# EAGLE design shield_mega_seed4_mpu_lobo9 (EAGLE 9.3.0)
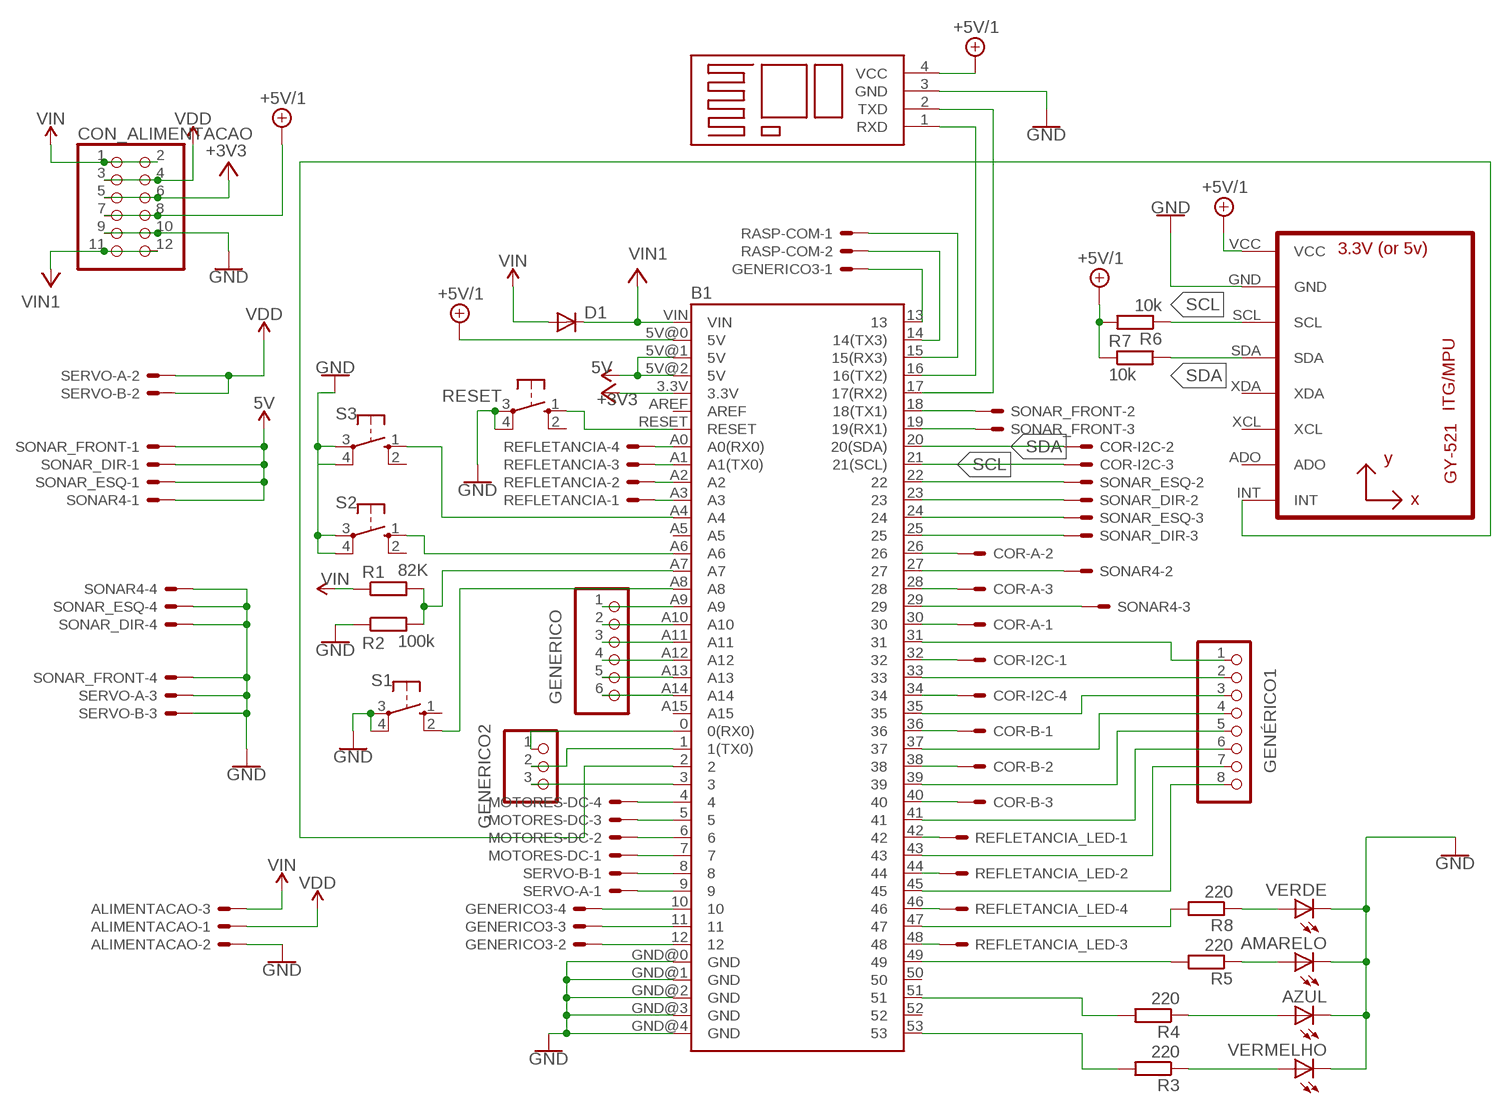
[diagram p0: schematic, sheet 1]

## Parts
ALIMENTACAO  22-23-2031  [22-23-2031]
AMARELO  LED5MM  [LED5MM]
AZUL  LED5MM  [LED5MM]
B1  ARDUINO_MEGA_R3FULL  [ARDUINO_MEGA]
B2  BLUETOOTH  [BLUETOOTH]
CON_ALIMENTACAO  PINHD-2X6  [2X06]
COR-A  22-23-2031  [22-23-2031]
COR-B  22-23-2031  [22-23-2031]
COR-I2C  22-23-2041  [22-23-2041]
D1  1N4004  [DO41-10]
GENERICO  PINHD-1X6  [1X06]
GENERICO2  PINHD-1X3  [1X03]
GENERICO3  22-23-2041  [22-23-2041]
GENÉRICO1  PINHD-1X8  [1X08]
MOTORES-DC  22-23-2041  [22-23-2041]
R1  82K  R-EU_0204/7  [0204/7]
R2  100k  R-EU_0204/7  [0204/7]
R3  220  R-EU_0207/7  [0207/7]
R4  220  R-EU_0207/7  [0207/7]
R5  220  R-EU_0207/7  [0207/7]
R6  10k  R-EU_0204/7  [0204/7]
R7  10k  R-EU_0204/7  [0204/7]
R8  220  R-EU_0207/7  [0207/7]
RASP-COM  22-23-2021  [22-23-2021]
REFLETANCIA  22-23-2041  [22-23-2041]
REFLETANCIA_LED  22-23-2041  [22-23-2041]
RESET  10-XX  [B3F-10XX]
S1  10-XX  [B3F-10XX]
S2  10-XX  [B3F-10XX]
S3  10-XX  [B3F-10XX]
SERVO-A  22-23-2031  [22-23-2031]
SERVO-B  22-23-2031  [22-23-2031]
SONAR4  22-23-2041  [22-23-2041]
SONAR_DIR  22-23-2041  [22-23-2041]
SONAR_ESQ  22-23-2041  [22-23-2041]
SONAR_FRONT  22-23-2041  [22-23-2041]
U1  GY-521MPU6050  [GY-521]
VERDE  LED5MM  [LED5MM]
VERMELHO  LED5MM  [LED5MM]

## Nets
5V: B1.5V@1(5V) B1.5V@2(5V) SONAR4.1 SONAR_DIR.1 SONAR_ESQ.1 SONAR_FRONT.1
+3V3: B1.3.3V CON_ALIMENTACAO.5 CON_ALIMENTACAO.6
+5V/1: B1.5V@0(5V) B2.4(VCC) CON_ALIMENTACAO.7 CON_ALIMENTACAO.8 R6.2 R7.1 U1.VCC
GND: ALIMENTACAO.2 AMARELO.K(C) AZUL.K(C) B1.GND@0(GND) B1.GND@1(GND) B1.GND@2(GND) B1.GND@3(GND) B1.GND@4(GND) B2.3(GND) CON_ALIMENTACAO.9 CON_ALIMENTACAO.10 R2.1 RESET.3(P) RESET.4(P1) S1.3(P) S1.4(P1) S2.3(P) S2.4(P1) S3.3(P) S3.4(P1) SERVO-A.3 SERVO-B.3 SONAR4.4 SONAR_DIR.4 SONAR_ESQ.4 SONAR_FRONT.4 U1.GND VERDE.K(C) VERMELHO.K(C)
N$1: B1.A2 REFLETANCIA.2
N$2: B1.A3 REFLETANCIA.1
N$3: B1.4 MOTORES-DC.4
N$4: B1.5 MOTORES-DC.3
N$5: B1.6 MOTORES-DC.2
N$6: B1.7 MOTORES-DC.1
N$7: B1.8 SERVO-B.1
N$8: B1.9 SERVO-A.1
N$9: B1.14(14(TX3)) RASP-COM.2
N$10: B1.15(15(RX3)) RASP-COM.1
N$11: B1.19(19(RX1)) SONAR_FRONT.3
N$12: B1.18(18(TX1)) SONAR_FRONT.2
N$13: B1.16(16(TX2)) B2.1(RXD)
N$14: B1.30 COR-A.1
N$15: B1.26 COR-A.2
N$16: B1.34 COR-I2C.4
N$17: B1.36 COR-B.1
N$18: B1.38 COR-B.2
N$19: B1.40 COR-B.3
N$20: B1.A7 R1.2 R2.2
N$21: B1.51 R4.2
N$22: B1.53 R3.2
N$23: B1.49 R5.2
N$24: AMARELO.A R5.1
N$25: AZUL.A R4.1
N$26: R3.1 VERMELHO.A
N$27: B1.27 SONAR4.2
N$28: B1.A6 S2.1(S)
N$29: B1.A1(A1(TX0)) REFLETANCIA.3
N$30: B1.29 SONAR4.3
N$31: B1.RESET RESET.1(S)
N$32: B1.0(0(RX0)) GENERICO2.1
N$33: B1.A0(A0(RX0)) REFLETANCIA.4
N$34: B1.25 SONAR_DIR.3
N$35: B1.24 SONAR_ESQ.3
N$36: B1.23 SONAR_DIR.2
N$37: B1.22 SONAR_ESQ.2
N$38: B1.47 R8.2
N$39: B1.2 U1.INT
N$40: B1.32 COR-I2C.1
N$41: B1.28 COR-A.3
N$42: R8.1 VERDE.A
N$43: B1.17(17(RX2)) B2.2(TXD)
N$44: B1.10 GENERICO3.4
N$45: B1.12 GENERICO3.2
N$46: B1.11 GENERICO3.3
N$47: B1.13 GENERICO3.1
N$48: B1.42 REFLETANCIA_LED.1
N$49: B1.44 REFLETANCIA_LED.2
N$50: B1.46 REFLETANCIA_LED.4
N$51: B1.48 REFLETANCIA_LED.3
N$52: B1.A14 GENERICO.6
N$53: B1.A13 GENERICO.5
N$54: B1.A12 GENERICO.4
N$55: B1.A11 GENERICO.3
N$56: B1.A10 GENERICO.2
N$57: B1.A9 GENERICO.1
N$58: B1.A8 S1.2(S1)
N$59: B1.A4 S3.1(S)
N$60: B1.31 GENÉRICO1.1
N$61: B1.33 GENÉRICO1.2
N$62: B1.35 GENÉRICO1.3
N$63: B1.37 GENÉRICO1.4
N$64: B1.39 GENÉRICO1.5
N$65: B1.41 GENÉRICO1.6
N$66: B1.43 GENÉRICO1.7
N$67: B1.45 GENÉRICO1.8
N$68: B1.1(1(TX0)) GENERICO2.2
N$69: B1.3 GENERICO2.3
SCL: B1.21(21(SCL)) COR-I2C.3 R6.1 U1.SCL
SDA: B1.20(20(SDA)) COR-I2C.2 R7.2 U1.SDA
V+: B1.VIN CON_ALIMENTACAO.11 CON_ALIMENTACAO.12 D1.C ; supply symbol labelled VIN1
VDD: ALIMENTACAO.1 CON_ALIMENTACAO.3 CON_ALIMENTACAO.4 SERVO-A.2 SERVO-B.2
VIN: ALIMENTACAO.3 CON_ALIMENTACAO.1 CON_ALIMENTACAO.2 D1.A R1.1
Unconnected: B1.50 B1.52 B1.A5 B1.A15 B1.AREF RESET.2(S1) S1.1(S) S2.2(S1) S3.2(S1) U1.ADO U1.XCL U1.XDA

## Library data of the parts
ALIMENTACAO COR-A COR-B SERVO-A SERVO-B = con-molex:22-23-2031: .100" (2.54mm) Center Header - 3 Pin; MF: MOLEX; MPN: 22-23-2031; OC_FARNELL: 1462950; OC_NEWARK: 30C0862
AMARELO AZUL VERDE VERMELHO = led:LED: LED OSRAM: - CHIPLED LG R971, LG N971, LY N971, LG Q971, LY Q971, LO R971, LY R971 LH N974, LH R974 LS Q976, LO Q976, LY Q976 LO Q996 - Hyper CHIPLED LW Q18S LB Q993, LB Q99A, LB R99A - SideLED LS A670, LO A670, LY A670, LG A670, LP A670 LB A673, LV A673, LT A673, LW A673 LH A674 LY A675 LS A676, LA A676, LO A676, LY A676, LW A676 LS A679, LY A679, LG A679 - Hyper Micro SIDELED® LS Y876, LA Y876, LO Y876, LY Y876 LT Y87S - SmartLED LW L88C, LW L88S LB L89C, LB L89S, LG L890 LS L89K, LO L89K, LY L89K LS L896, LA L896, LO L896, LY L896 - TOPLED LS T670, LO T670, LY T670, LG T670, LP T670 LSG T670, LSP T670, LSY T670, LOP T670, LYG T670 LG T671, LOG T671, LSG T671 LB T673, LV T673, LT T673, LW T673 LH T674 LS T676, LA T676, LO T676, LY T676, LB T676, LH T676, LSB T676, LW T676 LB T67C, LV T67C, LT T67C, LS T67K, LO T67K, LY T67K, LW E67C LS E67B, LA E67B, LO E67B, LY E67B, LB E67C, LV E67C, LT E67C LW T67C LS T679, LY T679, LG T679 LS T770, LO T770, LY T770, LG T770, LP T770 LB T773, LV T773, LT T773, LW T773 LH T774 LS E675, LA E675, LY E675, LS T675 LS T776, LA T776, LO T776, LY T776, LB T776 LHGB T686 LT T68C, LB T68C - Hyper Mini TOPLED® LB M676 - Mini TOPLED Santana® LG M470 LS M47K, LO M47K, LY M47K Source: http://www.osram.convergy.de LUXEON: - LUMILED® LXK2-PW12-R00, LXK2-PW12-S00, LXK2-PW14-U00, LXK2-PW14-V00 LXK2-PM12-R00, LXK2-PM12-S00, LXK2-PM14-U00 LXK2-PE12-Q00, LXK2-PE12-R00, LXK2-PE12-S00, LXK2-PE14-T00, LXK2-PE14-U00 LXK2-PB12-K00, LXK2-PB12-L00, LXK2-PB12-M00, LXK2-PB14-N00, LXK2-PB14-P00, LXK2-PB14-Q00 LXK2-PR12-L00, LXK2-PR12-M00, LXK2-PR14-Q00, LXK2-PR14-R00 LXK2-PD12-Q00, LXK2-PD12-R00, LXK2-PD12-S00 LXK2-PH12-R00, LXK2-PH12-S00 LXK2-PL12-P00, LXK2-PL12-Q00, LXK2-PL12-R00 Source: www.luxeon.com KINGBRIGHT: KA-3528ASYC Source: www.kingbright.com
B1 = SparkFun-Boards3:ARDUINO_MEGA_R3: Arduino Mega R3 ATmega2560 R3 compatible footprint. SparkFun Products: Arduino Mega 2560 R3 <https://www.sparkfun.com/products/11061>
B2 = Bluetooth:BLUETOOTH
CON_ALIMENTACAO = pinhead:PINHD-2X6: PIN HEADER
COR-I2C GENERICO3 MOTORES-DC REFLETANCIA REFLETANCIA_LED SONAR4 SONAR_DIR SONAR_ESQ SONAR_FRONT = con-molex:22-23-2041: .100" (2.54mm) Center Header - 4 Pin; MF: MOLEX; MPN: 22-23-2041; OC_FARNELL: 1462920; OC_NEWARK: 38C0355
D1 = diode:1N4004: DIODE general purpose rectifier, 1 A
GENERICO = pinhead:PINHD-1X6: PIN HEADER
GENERICO2 = pinhead:PINHD-1X3: PIN HEADER
GENÉRICO1 = pinhead:PINHD-1X8: PIN HEADER
R1-R8 = rcl:R-EU_: RESISTOR, European symbol
RASP-COM = con-molex:22-23-2021: .100" (2.54mm) Center Header - 2 Pin; MF: MOLEX; MPN: 22-23-2021; OC_FARNELL: 1462926; OC_NEWARK: 25C3832
RESET S1-S3 = switch-omron:10-XX: OMRON SWITCH; MPN: B3F-1000; OC_FARNELL: 176432; OC_NEWARK: 36M3542
U1 = gy-521:GY-521

## Board
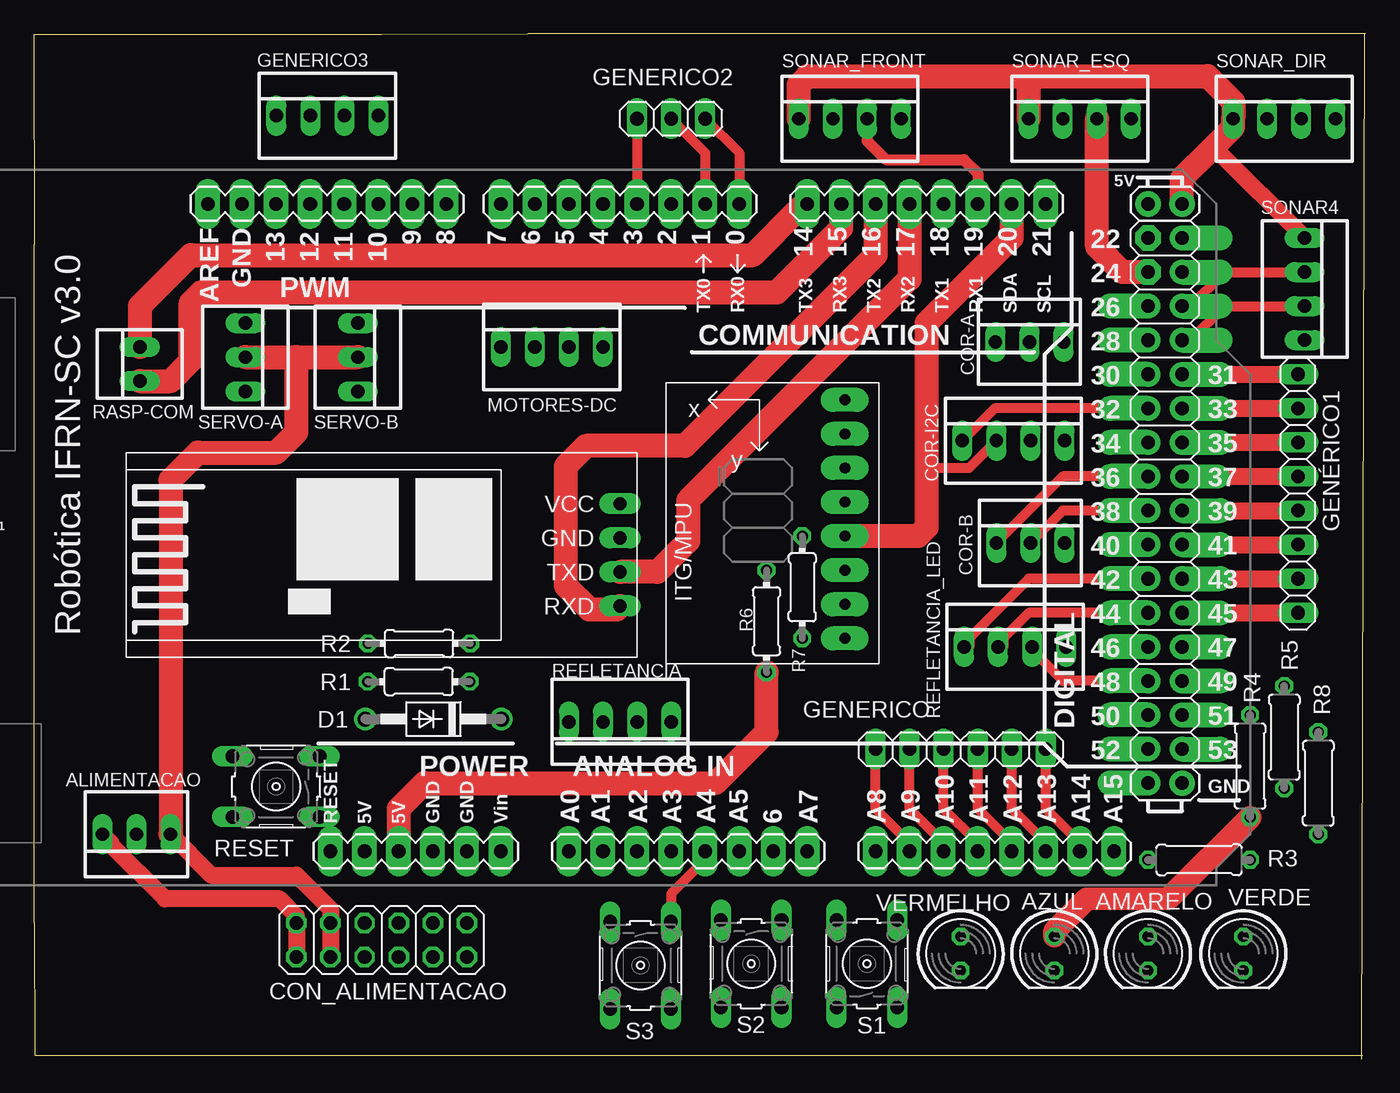
[diagram p1: board, top side]
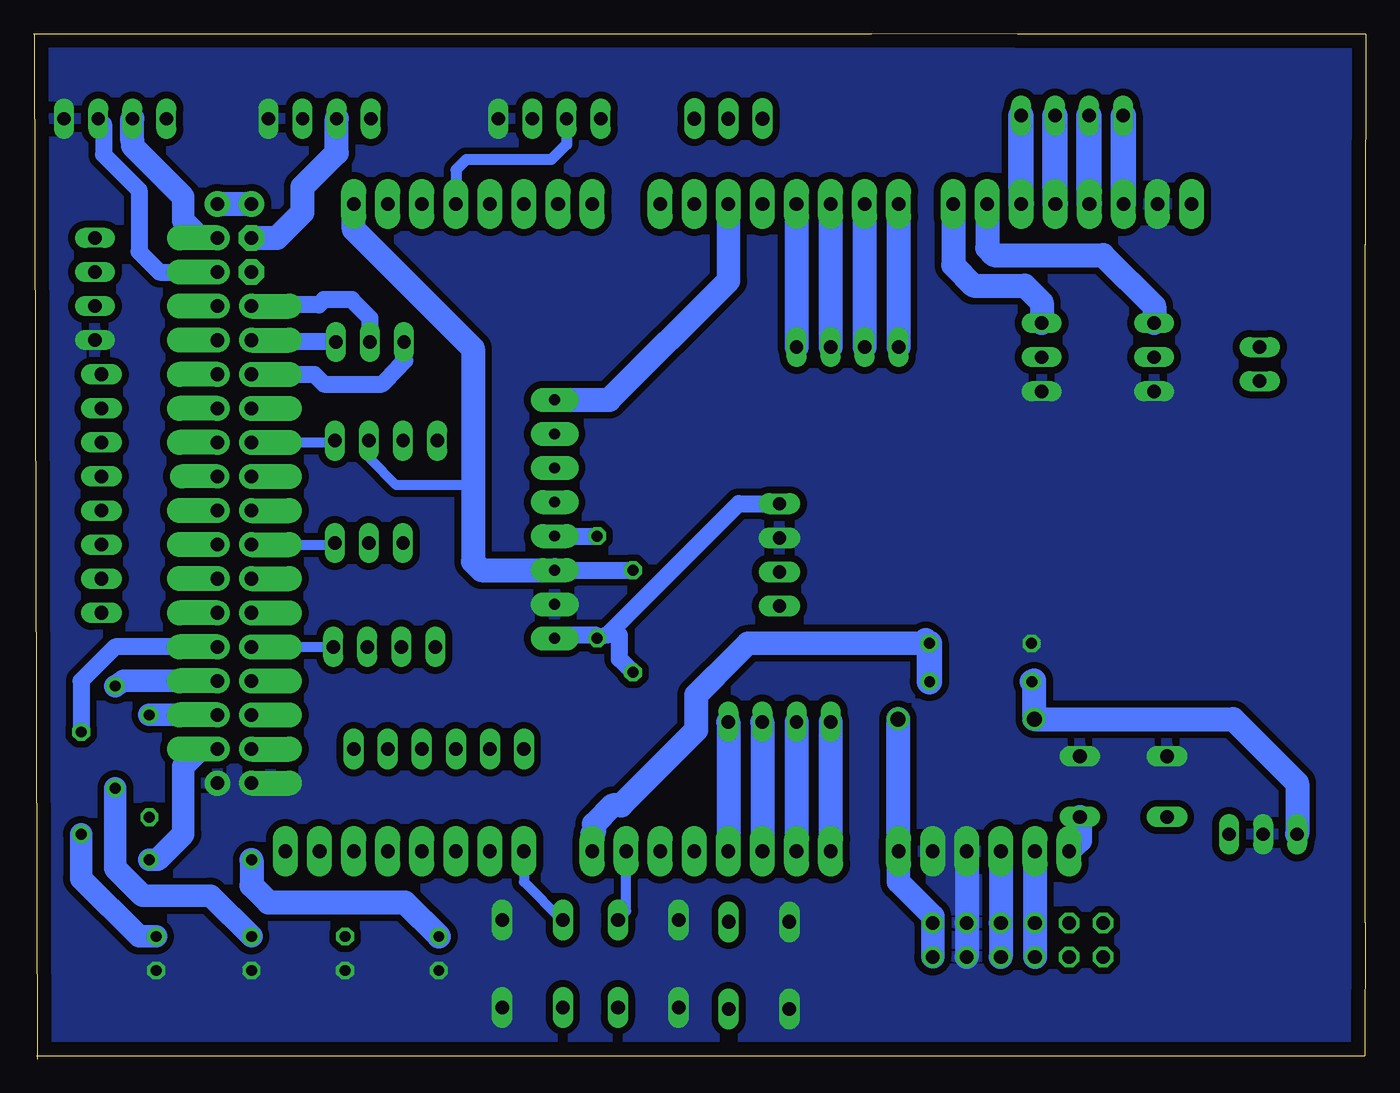
[diagram p2: board, bottom side, seen from below]

Size 99.36 x 76.45 mm. Coordinates in mm from the lower left corner, seen from the top.
Outline: 99.03,0 99.29,76.44
Outline: 99.11,0.25 0.1,0.25 0.05,10.16 0.05,60.71 0,76.4 25.96,76.4 36.88,76.45 99.36,76.45
Copper layers (1*16): Top 0.035mm / dielectric 1.5mm / Bottom 0.035mm
Design rules "default *": minimum track width 30mil, minimum drill 24mil, track to track 20mil, track to pad 20mil, pad to pad 20mil, via to via 20mil, smd to smd 8mil, copper to edge 40mil, drill to drill 8mil, minimum pad ring 10mil, minimum via ring 8mil, stop-mask expansion 4mil, vias tented up to drill 0mil, thermal gap 0mil

### Footprints (pad centres in the part's own frame; a part is rotated, then mirrored left to right if it is on the bottom)
22-23-2031 = drill 1 long: 1 -2.54,0; 2 0,0; 3 2.54,0
LED5MM = drill 0.813 octagon: A -1.27,0; K 1.27,0
ARDUINO_MEGA = drill 1.016 pad 1.88 long: 0 13.97,24.13; 1 11.43,24.13; 2 8.89,24.13; 3 6.35,24.13; 3.3V -13.97,-24.13; 4 3.81,24.13; 5 1.27,24.13; 5V@0 -11.43,-24.13; 6 -1.27,24.13; 7 -3.81,24.13; 8 -7.874,24.13; 9 -10.414,24.13; 10 -12.954,24.13; 11 -15.494,24.13; 12 -18.034,24.13; 13 -20.574,24.13; 14 19.05,24.13; 15 21.59,24.13; 16 24.13,24.13; 17 26.67,24.13; 18 29.21,24.13; 19 31.75,24.13; 20 34.29,24.13; 21 36.83,24.13; A0 1.27,-24.13; A1 3.81,-24.13; A2 6.35,-24.13; A3 8.89,-24.13; A4 11.43,-24.13; A5 13.97,-24.13; A6 16.51,-24.13; A7 19.05,-24.13; A8 24.13,-24.13; A9 26.67,-24.13; A10 29.21,-24.13; A11 31.75,-24.13; A12 34.29,-24.13; A13 36.83,-24.13; A14 39.37,-24.13; A15 41.91,-24.13; AREF -25.654,24.13; GND@0 -8.89,-24.13; GND@1 -6.35,-24.13; GND@4 -23.114,24.13; RESET -16.51,-24.13; VIN -3.81,-24.13 | drill 1.016 pad 1.88: 5V@1 44.45,24.13; 5V@2 46.99,24.13; GND@3 46.99,-19.05 | drill 1.016 pad 1.88 octagon: 22 44.45,21.59; 24 44.45,19.05 | drill 1.016 pad 1.88 offset: 23 46.99,21.59; 25 46.99,19.05; 26 44.45,16.51; 27 46.99,16.51; 28 44.45,13.97; 29 46.99,13.97; 30 44.45,11.43; 31 46.99,11.43; 32 44.45,8.89; 33 46.99,8.89; 34 44.45,6.35; 35 46.99,6.35; 36 44.45,3.81; 38 44.45,1.27; 39 46.99,1.27; 40 44.45,-1.27; 41 46.99,-1.27; 42 44.45,-3.81; 43 46.99,-3.81; 44 44.45,-6.35; 45 46.99,-6.35; 46 44.45,-8.89; 47 46.99,-8.89; 48 44.45,-11.43; 49 46.99,-11.43; 50 44.45,-13.97; 51 46.99,-13.97; 52 44.45,-16.51; 53 46.99,-16.51; GND@2 44.45,-19.05 | drill 1 pad 1.778 offset: 37 46.99,3.81
BLUETOOTH = drill 1 pad 1.549 long: 1 -6.35,3.81; 2 -6.35,1.27; 3 -6.35,-1.27; 4 -6.35,-3.81
2X06 = drill 1.016 octagon: 1 -6.35,-1.27; 2 -6.35,1.27; 3 -3.81,-1.27; 4 -3.81,1.27; 5 -1.27,-1.27; 6 -1.27,1.27; 7 1.27,-1.27; 8 1.27,1.27; 9 3.81,-1.27; 10 3.81,1.27; 11 6.35,-1.27; 12 6.35,1.27
22-23-2041 = drill 1 long: 1 -3.81,0; 2 -1.27,0; 3 1.27,0; 4 3.81,0
DO41-10 = drill 1.118: A 5.08,0; C -5.08,0
1X06 = drill 1.016 long: 1 -6.35,0; 2 -3.81,0; 3 -1.27,0; 4 1.27,0; 5 3.81,0; 6 6.35,0
1X03 = drill 1.016 long: 1 -2.54,0; 2 0,0; 3 2.54,0
1X08 = drill 1.016 long: 1 -8.89,0; 2 -6.35,0; 3 -3.81,0; 4 -1.27,0; 5 1.27,0; 6 3.81,0; 7 6.35,0; 8 8.89,0
0204/7 = drill 0.813 octagon: 1 -3.81,0; 2 3.81,0
0207/7 = drill 0.813 octagon: 1 -3.81,0; 2 3.81,0
22-23-2021 = drill 1 long: 1 -1.27,0; 2 1.27,0
B3F-10XX = drill 1.016 long: 1 -3.251,2.261; 2 3.251,2.261; 3 -3.251,-2.261; 4 3.251,-2.261
GY-521 = drill 0.8 pad 1.778 long: ADO -8.89,-6.35; GND -8.89,6.35; INT -8.89,-8.89; SCL -8.89,3.81; SDA -8.89,1.27; VCC -8.89,8.89; XCL -8.89,-3.81; XDA -8.89,-1.27

### Placement (x,y rotation side)
ALIMENTACAO  7.67,16.76 180 top
AMARELO  83.11,7.87 270 top
AZUL  76.12,7.87 270 top
B1  38.66,39.62 0 top
B2  37.39,37.59 180 top
CON_ALIMENTACAO  25.96,8.89 0 top
COR-A  74.27,53.47 0 top
COR-B  74.35,38.48 0 top
COR-I2C  73.08,46.1 0 top
D1  29.82,25.35 180 top
GENERICO  69.14,23.11 0 top
GENERICO2  47.55,70.1 180 top
GENERICO3  21.92,70.33 0 top
GENÉRICO1  94.28,42.16 270 top
MOTORES-DC  38.66,53.09 0 top
R1  28.73,28.14 0 top
R2  28.75,30.99 0 top
R3  86.92,14.86 0 top
R4  90.73,21.84 90 top
R5  93.27,24 90 top
R6  54.66,32.64 270 top
R7  57.33,35.18 90 top
R8  95.81,20.57 90 top
RASP-COM  7.92,51.82 90 top
REFLETANCIA  43.74,25.15 180 top
REFLETANCIA_LED  73.2,30.73 0 top
RESET  18.08,20.32 180 top
S1  62.15,7.11 90 top
S2  53.52,7.11 270 top
S3  45.26,6.99 270 top
SERVO-A  15.8,52.32 270 top
SERVO-B  24.18,52.32 270 top
SONAR4  94.79,57.4 270 top
SONAR_DIR  93.27,70.1 0 top
SONAR_ESQ  78.03,70.1 0 top
SONAR_FRONT  60.88,70.1 0 top
U1  51.61,40.26 180 top
VERDE  90.22,7.87 270 top
VERMELHO  69.14,7.87 270 top

### Tracks (layer width: path | path; a pad name or v marks a point on that pad's centre or on a via)
5V
  Top 1.27: SONAR4.1 88.13,67.88 87.87,67.88
  Top 1.778: B1.5V@2 85.65,65.66 87.87,67.88 89.46,69.47 SONAR_DIR.1 89.46,71.37 87.55,73.28 74.85,73.28 74.54,72.96 | SONAR_ESQ.1 74.22,72.64 74.54,72.96 | 74.54,72.96 74.22,73.28 57.71,73.28 57.07,72.64 SONAR_FRONT.1
  Bottom 1.778: B1.5V@2 B1.5V@1
+3V3
  Bottom 1.78: B1.3.3V CON_ALIMENTACAO.6 CON_ALIMENTACAO.5
+5V/1
  Top 1.778: B1.5V@0 27.23,18.67 29.13,20.57 50.85,20.57 54.66,24.38 R6.2
  Bottom 1.27: U1.VCC 60.12,31.62 57.45,31.62 R7.1 56.57,31.62 56.12,32.07 | B2.4 46.79,41.4 56.12,32.07 | R6.2 55.68,29.84 55.68,31.62 56.12,32.07
  Bottom 1.78: B1.5V@0 CON_ALIMENTACAO.8 CON_ALIMENTACAO.7
GND
  Bottom 0.762: 51.51,10.41 51.29,10.36 S2.3
  Bottom 1.778: B1.GND@3 85.7,20.52
  Bottom 1.78: B1.GND@0 CON_ALIMENTACAO.10 CON_ALIMENTACAO.9
  pour Bottom: -0.2,76.45 99.36,76.45 99.36,0.51 -0.2,0.51
N$1
  Bottom 1.778: REFLETANCIA.2 B1.A2
N$2
  Bottom 1.778: REFLETANCIA.1 B1.A3
N$3
  Bottom 1.778: B1.4 MOTORES-DC.4
N$4
  Bottom 1.778: B1.5 MOTORES-DC.3
N$5
  Bottom 1.778: B1.6 MOTORES-DC.2
N$6
  Bottom 1.778: B1.7 MOTORES-DC.1
N$7
  Bottom 1.778: B1.8 30.78,59.18 29.26,57.66 25.45,57.66 24.18,56.39 SERVO-B.1
N$8
  Bottom 1.778: B1.9 28.24,60.45 27.74,59.94 19.61,59.94 15.8,56.13 SERVO-A.1
N$9
  Top 1.778: B1.14 57.45,63.5 57.2,63.5 53.64,59.94 11.73,59.94 7.92,56.13 RASP-COM.2
N$10
  Top 1.778: B1.15 60.25,61.98 55.42,57.15 12.5,57.15 11.73,56.39 11.73,52.07 10.21,50.55 RASP-COM.1
N$11
  Top 0.813: SONAR_FRONT.3 62.15,68.45 63.55,67.06 69.39,67.06 70.41,66.04 B1.19
N$12
  Bottom 0.813: SONAR_FRONT.2 59.61,68.2 60.76,67.06 67.11,67.06 67.87,66.29 B1.18
N$13
  Top 1.778: B1.16 62.79,59.94 48.56,45.72 41.2,45.72 39.67,44.2 39.67,35.31 41.45,33.53 43.48,33.53 B2.1
N$14
  Bottom 1.27: COR-A.1 71.75,53.44 71.75,52.15 71.68,52.07 72.13,51.62 72.13,51.58 73.38,50.32 77.7,50.32 78.43,51.05 B1.30
N$15
  Bottom 1.27: COR-A.2 74.27,55.24 75.63,56.61 77.7,56.61 78.07,56.24 83.01,56.24 B1.26
N$16
  Bottom 0.762: B1.34 77.39,45.97 COR-I2C.4
N$17
  Top 0.762: COR-B.1 76.76,43.43 B1.36
N$18
  Top 0.762: COR-B.2 76.76,40.89 B1.38
N$19
  Bottom 0.762: B1.40 77.39,38.35 COR-B.3
N$20
  Bottom 0.762: B1.A7 57.71,16.13 57.58,16.89
  Bottom 1.75: R2.2 46.1,30.99 48.56,28.52
  Bottom 1.778: 32.82,31.24 R2.2 | 48.56,28.52 49.95,27.14 49.95,24.53 55.55,18.92 56.17,18.92 57.58,17.51 57.58,16.89 57.71,16.76
  Bottom 1.905: R2.2 32.56,28.17 R1.2
N$21
  Bottom 1.676: B1.51 R4.2
N$22
  Bottom 1.676: R3.2 90.09,14.86 88.19,16.76 88.19,21.84 86.92,23.11 B1.53
N$23
  Bottom 1.676: B1.49 92.63,28.19 R5.2
N$24
  Bottom 1.676: R5.1 93.27,14.22 91.24,12.19 86.16,12.19 AMARELO.A
N$25
  Top 1.676: AZUL.A 76.12,9.53 78.54,11.94 84.63,11.94 R4.1
N$26
  Bottom 1.778: R3.1 83.11,12.95 81.84,11.68 71.68,11.68 VERMELHO.A
N$27
  Top 0.762: SONAR4.2 88.82,58.67 86.28,56.13 B1.27
N$28
  Bottom 0.762: B1.A6 55.17,11.05 55.76,10.46 S2.1
N$29
  Bottom 1.778: REFLETANCIA.3 B1.A1
N$30
  Top 0.762: SONAR4.3 88.82,56.13 86.28,53.59 B1.29
N$31
  Bottom 1.778: RESET.1 21.34,16.31 B1.RESET
N$32
  Top 0.762: B1.0 52.63,67.56 GENERICO2.1
N$33
  Bottom 1.778: REFLETANCIA.4 B1.A0
N$34
  Bottom 1.27: SONAR_DIR.3 94.14,69.71 94.14,67.42 91.49,64.77 91.49,60.2 89.97,58.67 B1.25
N$35
  Top 1.778: B1.24 81.2,58.67 79.3,60.58 SONAR_ESQ.3
N$36
  Bottom 1.676: 86.92,61.21 88.22,62.51 88.22,64.3 92,68.08 92,68.45
  Bottom 1.778: B1.23 86.92,61.21 | 92,68.45 SONAR_DIR.2
N$37
  Bottom 1.778: B1.22 81.2,61.21 79.3,63.12 79.3,65.02 76.76,67.56 SONAR_ESQ.2
N$38
  Bottom 1.27: B1.47 93.27,30.73 95.81,28.19 R8.2
N$39
  Bottom 1.75: 47.55,58.04 B1.2
  Bottom 1.778: U1.INT 56.44,49.15 47.55,58.04
N$40
  Top 0.762: COR-I2C.1 71.68,48.51 B1.32
N$41
  Bottom 1.27: COR-A.3 82.98,53.47 B1.28
N$42
  Bottom 1.676: R8.1 95.81,13.46 91.49,9.14 VERDE.A
N$43
  Top 1.778: B1.17 65.33,58.17 48.82,41.66 48.82,38.61 46.53,36.32 B2.2
N$44
  Bottom 1.905: GENERICO3.4 25.73,63.78 B1.10
N$45
  Bottom 1.905: GENERICO3.2 20.65,63.78 B1.12
N$46
  Bottom 1.905: GENERICO3.3 23.19,63.78 B1.11
N$47
  Bottom 1.905: GENERICO3.1 18.11,63.78 B1.13
N$48
  Top 0.762: B1.42 74.22,35.81 69.77,31.37 69.77,30.73 REFLETANCIA_LED.1
N$49
  Top 0.762: B1.44 74.22,33.27 72.31,31.37 72.31,30.73 REFLETANCIA_LED.2
N$50
  Bottom 0.762: B1.46 REFLETANCIA_LED.4
N$51
  Top 0.762: B1.48 76.76,28.19 74.85,30.1 74.85,30.73 REFLETANCIA_LED.3
N$52
  Top 0.762: GENERICO.6 75.49,18.67 78.03,16.13 B1.A14
N$53
  Top 0.762: GENERICO.5 72.95,18.67 75.49,16.13 B1.A13
N$54
  Top 0.762: GENERICO.4 70.41,18.67 72.95,16.13 B1.A12
N$55
  Top 0.762: GENERICO.3 67.87,18.67 70.41,16.13 B1.A11
N$56
  Top 0.762: GENERICO.2 65.33,18.67 67.87,16.13 B1.A10
N$57
  Top 0.762: GENERICO.1 62.79,18.67 65.33,16.13 B1.A9
N$58
  Bottom 0.762: B1.A8 62.79,13.21 59.94,10.36 S1.2
N$59
  Top 0.762: B1.A4 50.09,14.86 47.55,12.32 47.55,10.41 S3.1
N$60
  Top 1.27: B1.31 GENÉRICO1.1
N$61
  Top 1.27: B1.33 GENÉRICO1.2
N$62
  Top 1.27: B1.35 GENÉRICO1.3
N$63
  Top 1.27: B1.37 GENÉRICO1.4
N$64
  Top 1.27: B1.39 GENÉRICO1.5
N$65
  Top 1.27: B1.41 GENÉRICO1.6
N$66
  Top 1.27: B1.43 GENÉRICO1.7
N$67
  Top 1.27: B1.45 GENÉRICO1.8
N$68
  Top 0.762: B1.1 50.09,67.56 GENERICO2.2
N$69
  Top 0.762: GENERICO2.3 B1.3
SCL
  Bottom 0.762: 66.6,42.8 72.31,42.8 74.22,44.7 74.22,45.97 COR-I2C.3
  Bottom 1.27: U1.SCL R6.1
  Bottom 1.778: U1.SCL 65.96,36.45 66.6,37.08 66.6,42.8 66.6,52.96 75.49,61.85 B1.21
SDA
  Top 0.762: COR-I2C.2 69.77,44.07 66.6,44.07
  Top 1.778: U1.SDA 65.96,38.99 66.6,39.62 66.6,44.07 66.6,54.86 72.95,61.21 B1.20
  Bottom 1.27: U1.SDA R7.2
V+
  Bottom 1.75: B1.VIN 34.85,13.21 32.31,10.67 CON_ALIMENTACAO.12 CON_ALIMENTACAO.11
  Bottom 1.778: D1.C 34.9,15.54 B1.VIN
VDD
  Top 1.27: ALIMENTACAO.1 13.26,13.72 19.61,13.72 22.15,11.18 CON_ALIMENTACAO.4 CON_ALIMENTACAO.3
  Top 1.778: ALIMENTACAO.1 10.21,43.18 12.24,45.21 18.08,45.21 19.61,46.74 19.61,52.32 | SERVO-A.2 19.61,52.32 | 19.61,52.32 SERVO-B.2
VIN
  Top 1.27: CON_ALIMENTACAO.1 CON_ALIMENTACAO.2 19.61,10.67 18.34,11.94 9.81,11.94 5.77,15.98 5.77,16.12 ALIMENTACAO.3
  Bottom 1.778: ALIMENTACAO.3 5.13,20.57 9.91,25.35 D1.A 24.74,28.22 R1.1

### Text on the board
tPlace: Robótica IFRN-SC v3.0